# EAGLE design LatarSnapProbes (EAGLE 9.5.2)
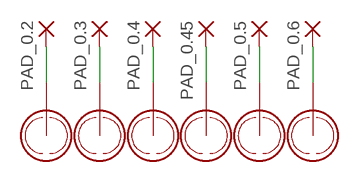
[diagram p0: schematic, sheet 1]

## Parts
P1  PROBE_0.2_IN  [PROBE_0.2_IN]
PAD_0.2  SMD5  [SMD2,54-5,08]
PAD_0.3  SMD5  [SMD2,54-5,08]
PAD_0.4  SMD5  [SMD2,54-5,08]
PAD_0.5  SMD5  [SMD2,54-5,08]
PAD_0.6  SMD5  [SMD2,54-5,08]
PAD_0.45  SMD5  [SMD2,54-5,08]
U$1  PROBE_0.4_IN  [PROBE_0.4_IN]
U$3  PROBE_0.3_IN  [PROBE_0.3_IN]
U$4  PROBE_0.45_IN  [PROBE_0.45_IN]
U$5  PROBE_0.5_IN  [PROBE_0.5_IN]
U$6  PROBE_0.6_IN  [PROBE_0.6_IN]

## Nets
N$1: P1.P1 P1.P2 PAD_0.2.1(P)
N$2: PAD_0.3.1(P) U$3.P1 U$3.P2
N$3: PAD_0.4.1(P) U$1.P1 U$1.P2
N$4: PAD_0.45.1(P) U$4.P1 U$4.P2
N$5: PAD_0.5.1(P) U$5.P1 U$5.P2
N$6: PAD_0.6.1(P) U$6.P1 U$6.P2

## Library data of the parts
P1 = hm-touch:PROBE_0.2_IN
PAD_0.2-PAD_0.6 PAD_0.45 = wirepad:SMD5: SMD PAD
U$1 = hm-touch:PROBE_0.4_IN
U$3 = hm-touch:PROBE_0.3_IN
U$4 = hm-touch:PROBE_0.45_IN
U$5 = hm-touch:PROBE_0.5_IN
U$6 = hm-touch:PROBE_0.6_IN

## Board
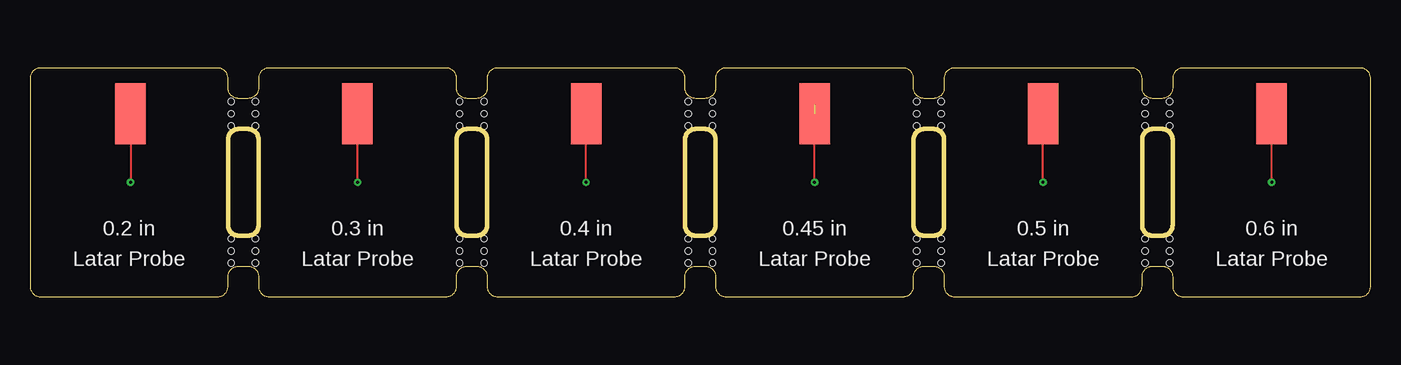
[diagram p1: board, top side]
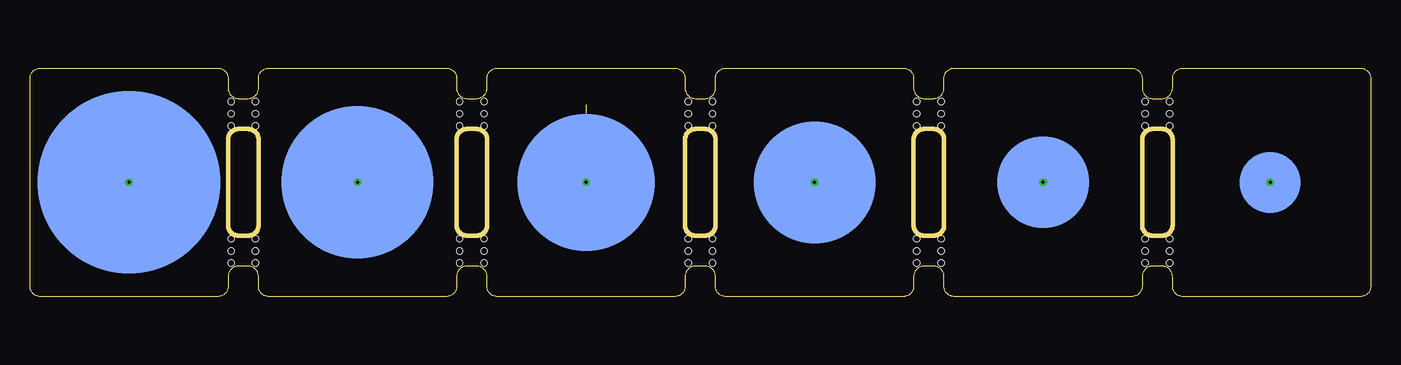
[diagram p2: board, bottom side, seen from below]

Size 111.76 x 19.05 mm. Coordinates in mm from the lower left corner, seen from the top.
Outline: 15.65,19.05 0.86,19.05 arc90 0,18.19 0,0.86 arc90 0.86,0 15.65,0 arc90 16.51,0.86 16.51,1.68 arc-90 17.37,2.54 18.19,2.54 arc-90 19.05,1.68 19.05,0.86 arc90 19.91,0 34.7,0 arc90 35.56,0.86 35.56,1.68 arc-90 36.42,2.54 37.24,2.54 arc-90 38.1,1.68 38.1,0.86 arc90 38.96,0 53.75,0 arc90 54.61,0.86 54.61,1.68 arc-90 55.47,2.54 56.29,2.54 arc-90 57.15,1.68 57.15,0.86 arc90 58.01,0 72.8,0 arc90 73.66,0.86 73.66,1.68 arc-90 74.52,2.54 75.34,2.54 arc-90 76.2,1.68 76.2,0.86 arc90 77.06,0 91.85,0 arc90 92.71,0.86 92.71,1.68 arc-90 93.57,2.54 94.39,2.54 arc-90 95.25,1.68 95.25,0.86 arc90 96.11,0 110.9,0 arc90 111.76,0.86 111.76,18.19 arc90 110.9,19.05 96.11,19.05 arc90 95.25,18.19 95.25,17.37 arc-90 94.39,16.51 93.57,16.51 arc-90 92.71,17.37 92.71,18.19 arc90 91.85,19.05 77.06,19.05 arc90 76.2,18.19 76.2,17.37 arc-90 75.34,16.51 74.52,16.51 arc-90 73.66,17.37 73.66,18.19 arc90 72.8,19.05 58.01,19.05 arc90 57.15,18.19 57.15,17.37 arc-90 56.29,16.51 55.47,16.51 arc-90 54.61,17.37 54.61,18.19 arc90 53.75,19.05 38.96,19.05 arc90 38.1,18.19 38.1,17.37 arc-90 37.24,16.51 36.42,16.51 arc-90 35.56,17.37 35.56,18.19 arc90 34.7,19.05 19.91,19.05 arc90 19.05,18.19 19.05,17.37 arc-90 18.19,16.51 17.37,16.51 arc-90 16.51,17.37 16.51,18.19 arc90 15.65,19.05
Outline: 17.37,5.08 18.19,5.08 arc90 19.05,5.94 19.05,13.11 arc90 18.19,13.97 17.37,13.97 arc90 16.51,13.11 16.51,5.94 arc90 17.37,5.08
Outline: 36.42,5.08 37.24,5.08 arc90 38.1,5.94 38.1,13.11 arc90 37.24,13.97 36.42,13.97 arc90 35.56,13.11 35.56,5.94 arc90 36.42,5.08
Outline: 55.47,5.08 56.29,5.08 arc90 57.15,5.94 57.15,13.11 arc90 56.29,13.97 55.47,13.97 arc90 54.61,13.11 54.61,5.94 arc90 55.47,5.08
Outline: 74.52,5.08 75.34,5.08 arc90 76.2,5.94 76.2,13.11 arc90 75.34,13.97 74.52,13.97 arc90 73.66,13.11 73.66,5.94 arc90 74.52,5.08
Outline: 93.57,5.08 94.39,5.08 arc90 95.25,5.94 95.25,13.11 arc90 94.39,13.97 93.57,13.97 arc90 92.71,13.11 92.71,5.94 arc90 93.57,5.08
Copper layers (1*16): Top 0.0356mm / dielectric 1.5011mm / Bottom 0.0356mm
Design rules "LaenPCBOrder": minimum track width 6mil, minimum drill 13mil, track to track 6mil, track to pad 6mil, pad to pad 6mil, via to via 6mil, smd to smd 6mil, copper to edge 15mil, drill to drill 6mil, minimum pad ring 7mil, minimum via ring 7mil, stop-mask expansion 3mil, vias tented up to drill 0mil, thermal gap 10mil
Holes 0.51 mm at 16.76,14.22 16.76,16.26 16.76,15.24 18.8,16.26 18.8,14.22 18.8,15.24 16.76,2.79 16.76,4.83 16.76,3.81 18.8,4.83 18.8,2.79 18.8,3.81 35.81,14.22 35.81,16.26 35.81,15.24 37.85,16.26 37.85,14.22 37.85,15.24 35.81,2.79 35.81,4.83 35.81,3.81 37.85,4.83 37.85,2.79 37.85,3.81 54.86,14.22 54.86,16.26 54.86,15.24 56.9,16.26 56.9,14.22 56.9,15.24 54.86,2.79 54.86,4.83 54.86,3.81 56.9,4.83 56.9,2.79 56.9,3.81 73.91,14.22 73.91,16.26 73.91,15.24 75.95,16.26 75.95,14.22 75.95,15.24 73.91,2.79 73.91,4.83 73.91,3.81 75.95,4.83 75.95,2.79 75.95,3.81 92.96,14.22 92.96,16.26 92.96,15.24 95,16.26 95,14.22 95,15.24 92.96,2.79 92.96,4.83 92.96,3.81 95,4.83 95,2.79 95,3.81
Milling: area 16.5,5.1 to 19.1,14; area 35.6,5.1 to 38.1,14; area 54.6,5.1 to 57.1,14; area 73.7,5.1 to 76.2,14; area 92.7,5.1 to 95.2,14

### Footprints (pad centres in the part's own frame; a part is rotated, then mirrored left to right if it is on the bottom)
PROBE_0.2_IN = smd 5.08 x 5.08: P1 0,0 | drill 0.254: P2 0,0
SMD2,54-5,08 = smd 2.54 x 5.08: 1 0,0
PROBE_0.4_IN = smd 10.16 x 10.16: P1 0,0 | drill 0.254: P2 0,0
PROBE_0.3_IN = smd 7.62 x 7.62: P1 0,0 | drill 0.254: P2 0,0
PROBE_0.45_IN = smd 11.43 x 11.43: P1 0,0 | drill 0.254: P2 0,0
PROBE_0.5_IN = smd 12.7 x 12.7: P1 0,0 | drill 0.254: P2 0,0
PROBE_0.6_IN = smd 15.24 x 15.24: P1 0,0 | drill 0.254: P2 0,0

### Placement (x,y rotation side)
P1  8.38,9.53 0 bottom
PAD_0.2  8.38,15.24 180 top
PAD_0.3  27.3,15.24 180 top
PAD_0.4  46.35,15.24 180 top
PAD_0.5  84.45,15.24 180 top
PAD_0.6  103.51,15.24 180 top
PAD_0.45  65.41,15.24 180 top
U$1  46.35,9.53 180 bottom
U$3  27.3,9.53 0 bottom
U$4  65.41,9.53 0 bottom
U$5  84.45,9.53 0 bottom
U$6  103.51,9.53 0 bottom

### Tracks (layer width: path | path; a pad name or v marks a point on that pad's centre or on a via)
N$1
  Top 0.152: PAD_0.2.1 P1.P2
N$2
  Top 0.152: U$3.P1 PAD_0.3.1
N$3
  Top 0.152: U$1.P2 PAD_0.4.1
N$4  (1 unrouted)
  Top 0.152: U$4.P2 65.41,16
N$5
  Top 0.152: U$5.P2 PAD_0.5.1
N$6
  Top 0.152: U$6.P1 PAD_0.6.1

### Text on the board
tPlace: 0.2 in | 0.3 in | 0.4 in | 0.45 in | 0.5 in | 0.6 in | Latar Probe | Latar Probe | Latar Probe | Latar Probe | Latar Probe | Latar Probe